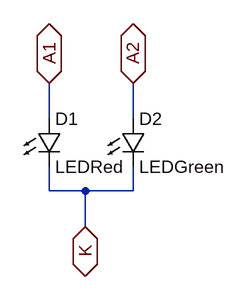
[diagram p0: schematic LED_BICOLOR.asc]
LED_BICOLOR.asc, the LTspice schematic file:
Version 4
SHEET 1 880 680
WIRE 144 80 144 32
WIRE 256 80 256 32
WIRE 144 176 144 144
WIRE 192 176 144 176
WIRE 256 176 256 144
WIRE 256 176 192 176
WIRE 192 224 192 176
FLAG 192 224 K
IOPIN 192 224 BiDir
FLAG 144 32 A1
IOPIN 144 32 BiDir
FLAG 256 32 A2
IOPIN 256 32 BiDir
SYMBOL LED 128 80 R0
SYMATTR InstName D1
SYMATTR Value LEDRed
SYMATTR Description Diode
SYMATTR Type diode
SYMBOL LED 240 80 R0
SYMATTR InstName D2
SYMATTR Value LEDGreen
SYMATTR Description Diode
SYMATTR Type diode

The netlist it stands for:
* LED_BICOLOR.asc
D1 A1 K LEDRed
D2 A2 K LEDGreen
.model D D
.lib standard.dio
.backanno
.end